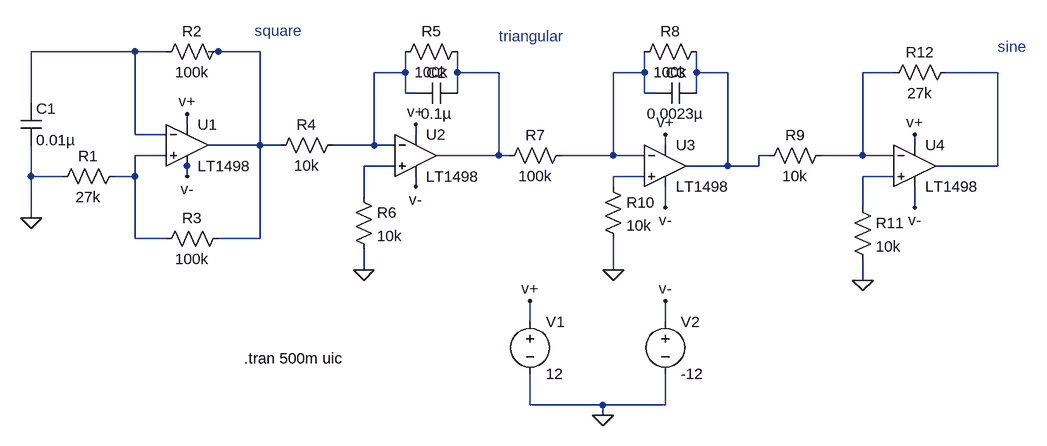
[diagram p0: schematic function generator.asc]
function generator.asc, the LTspice schematic file:
Version 4
SHEET 1 1412 680
WIRE 32 32 -128 32
WIRE 80 32 32 32
WIRE 160 32 144 32
WIRE 224 32 160 32
WIRE 448 64 448 32
WIRE 448 64 400 64
WIRE 528 64 528 32
WIRE 592 64 528 64
WIRE 816 64 816 32
WIRE 816 64 768 64
WIRE 896 64 896 32
WIRE 944 64 896 64
WIRE 1200 64 1152 64
WIRE 1360 64 1280 64
WIRE 448 96 448 64
WIRE 464 96 448 96
WIRE 528 96 528 64
WIRE 816 96 816 64
WIRE 832 96 816 96
WIRE 896 96 896 64
WIRE -128 112 -128 32
WIRE 112 144 112 128
WIRE 32 160 32 32
WIRE 80 160 32 160
WIRE 464 160 464 144
WIRE 224 176 224 32
WIRE 224 176 144 176
WIRE 256 176 224 176
WIRE 400 176 400 64
WIRE 400 176 336 176
WIRE 432 176 400 176
WIRE 848 176 848 160
WIRE 1232 176 1232 160
WIRE 80 192 32 192
WIRE 592 192 592 64
WIRE 592 192 496 192
WIRE 608 192 592 192
WIRE 768 192 768 64
WIRE 768 192 688 192
WIRE 816 192 768 192
WIRE 1008 192 992 192
WIRE 1152 192 1152 64
WIRE 1152 192 1088 192
WIRE 1200 192 1152 192
WIRE 112 208 112 192
WIRE 432 208 384 208
WIRE 944 208 944 64
WIRE 944 208 880 208
WIRE 992 208 992 192
WIRE 992 208 944 208
WIRE 1360 208 1360 64
WIRE 1360 208 1264 208
WIRE -128 224 -128 176
WIRE -80 224 -128 224
WIRE 32 224 32 192
WIRE 32 224 0 224
WIRE 112 224 112 208
WIRE 816 224 768 224
WIRE 1200 224 1152 224
WIRE 464 240 464 224
WIRE 768 240 768 224
WIRE 384 256 384 208
WIRE 848 272 848 240
WIRE 1152 272 1152 224
WIRE 1232 272 1232 240
WIRE -128 288 -128 224
WIRE 32 320 32 224
WIRE 80 320 32 320
WIRE 224 320 224 176
WIRE 224 320 160 320
WIRE 384 368 384 336
WIRE 768 368 768 320
WIRE 1152 384 1152 352
WIRE 640 448 640 416
WIRE 848 448 848 416
WIRE 640 576 640 528
WIRE 752 576 640 576
WIRE 848 576 848 528
WIRE 848 576 752 576
WIRE 752 592 752 576
FLAG -128 288 0
FLAG 384 368 0
FLAG 768 368 0
FLAG 1152 384 0
FLAG 752 592 0
FLAG 640 416 v+
FLAG 848 416 v-
FLAG 112 128 v+
FLAG 464 144 v+
FLAG 848 160 v+
FLAG 1232 160 v+
FLAG 112 224 v-
FLAG 464 240 v-
FLAG 848 272 v-
FLAG 1232 272 v-
SYMBOL cap -144 112 R0
SYMATTR InstName C1
SYMATTR Value 0.01µ
SYMBOL res 16 208 R90
WINDOW 0 0 56 VBottom 2
WINDOW 3 32 56 VTop 2
SYMATTR InstName R1
SYMATTR Value 27k
SYMBOL res 176 16 R90
WINDOW 0 0 56 VBottom 2
WINDOW 3 32 56 VTop 2
SYMATTR InstName R2
SYMATTR Value 100k
SYMBOL res 176 304 R90
WINDOW 0 0 56 VBottom 2
WINDOW 3 32 56 VTop 2
SYMATTR InstName R3
SYMATTR Value 100k
SYMBOL OpAmps\\LT1498 112 112 R0
SYMATTR InstName U1
SYMBOL res 352 160 R90
WINDOW 0 0 56 VBottom 2
WINDOW 3 32 56 VTop 2
SYMATTR InstName R4
SYMATTR Value 10k
SYMBOL OpAmps\\LT1498 464 128 R0
SYMATTR InstName U2
SYMBOL res 544 16 R90
WINDOW 0 0 56 VBottom 2
WINDOW 3 32 56 VTop 2
SYMATTR InstName R5
SYMATTR Value 100k
SYMBOL cap 528 80 R90
WINDOW 0 0 32 VBottom 2
WINDOW 3 32 32 VTop 2
SYMATTR InstName C2
SYMATTR Value 0.1µ
SYMBOL res 368 240 R0
SYMATTR InstName R6
SYMATTR Value 10k
SYMBOL res 704 176 R90
WINDOW 0 0 56 VBottom 2
WINDOW 3 32 56 VTop 2
SYMATTR InstName R7
SYMATTR Value 100k
SYMBOL res 912 16 R90
WINDOW 0 0 56 VBottom 2
WINDOW 3 32 56 VTop 2
SYMATTR InstName R8
SYMATTR Value 100k
SYMBOL res 1104 176 R90
WINDOW 0 0 56 VBottom 2
WINDOW 3 32 56 VTop 2
SYMATTR InstName R9
SYMATTR Value 10k
SYMBOL OpAmps\\LT1498 848 144 R0
SYMATTR InstName U3
SYMBOL res 752 224 R0
SYMATTR InstName R10
SYMATTR Value 10k
SYMBOL cap 896 80 R90
WINDOW 0 0 32 VBottom 2
WINDOW 3 32 32 VTop 2
SYMATTR InstName C3
SYMATTR Value 0.0023µ
SYMBOL OpAmps\\LT1498 1232 144 R0
SYMATTR InstName U4
SYMBOL res 1136 256 R0
SYMATTR InstName R11
SYMATTR Value 10k
SYMBOL res 1296 48 R90
WINDOW 0 0 56 VBottom 2
WINDOW 3 32 56 VTop 2
SYMATTR InstName R12
SYMATTR Value 27k
SYMBOL voltage 640 432 R0
WINDOW 123 0 0 Left 0
WINDOW 39 0 0 Left 0
SYMATTR InstName V1
SYMATTR Value 12
SYMBOL voltage 848 432 R0
WINDOW 123 0 0 Left 0
WINDOW 39 0 0 Left 0
SYMATTR InstName V2
SYMATTR Value -12
TEXT 200 504 Left 2 !.tran 500m uic
TEXT 216 0 Left 2 ;square
TEXT 592 8 Left 2 ;triangular
TEXT 1360 24 Left 2 ;sine

The netlist it stands for:
* function generator.asc
C1 N001 0 0.01µ
R1 N009 0 27k
R2 N002 N001 100k
R3 N002 N009 100k
XU1 N009 N001 v+ v- N002 LT1498  ; pins In+ In- V+ V- OUT
R4 N003 N002 10k
XU2 N010 N003 v+ v- N004 LT1498  ; pins In+ In- V+ V- OUT
R5 N004 N003 100k
C2 N004 N003 0.1µ
R6 N010 0 10k
R7 N005 N004 100k
R8 N006 N005 100k
R9 N007 N006 10k
XU3 N011 N005 v+ v- N006 LT1498  ; pins In+ In- V+ V- OUT
R10 N011 0 10k
C3 N006 N005 0.0023µ
XU4 N012 N007 v+ v- N008 LT1498  ; pins In+ In- V+ V- OUT
R11 N012 0 10k
R12 N008 N007 27k
V1 v+ 0 12
V2 v- 0 -12
.tran 500m uic
* square
* triangular
* sine
.lib LTC.lib
.backanno
.end